# EAGLE design RFP (EAGLE 7.7.0)
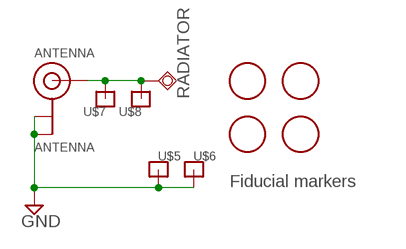
[diagram p0: schematic, sheet 1]

## Parts
ANTENNA  ANTENNA  ANTENNA_U.FL  [U.FL]
FD1  FIDUCIAL  [FIDUCIAL_1MM]
FD2  FIDUCIAL  [FIDUCIAL_1MM]
FD3  FIDUCIAL  [FIDUCIAL_1MM]
FD4  FIDUCIAL  [FIDUCIAL_1MM]
RADIATOR  TPSQTP20SQ  [TP20SQ]
U$5  2MMPILLAR  [2MMPILLAR]
U$6  2MMPILLAR  [2MMPILLAR]
U$7  2MMPILLAR  [2MMPILLAR]
U$8  2MMPILLAR  [2MMPILLAR]

## Nets
GND: ANTENNA.1(GND) ANTENNA.2(GND) U$5.P$1 U$6.P$1
SIGNAL: ANTENNA.3(SIGNAL) RADIATOR.TP U$7.P$1 U$8.P$1

## Notes on the sheet
- Fiducial markers

## Library data of the parts
ANTENNA = adafruit:ANTENNA_U.FL: U.FL Antenna Connector
FD1-FD4 = ubo_PQ60:FIDUCIAL: For use by pick and place machines to calibrate the vision/machine, 1mm By microbuilder.eu
RADIATOR = testpad:TPSQ: Test pad
U$5-U$8 = LMA:2MMPILLAR

## Board
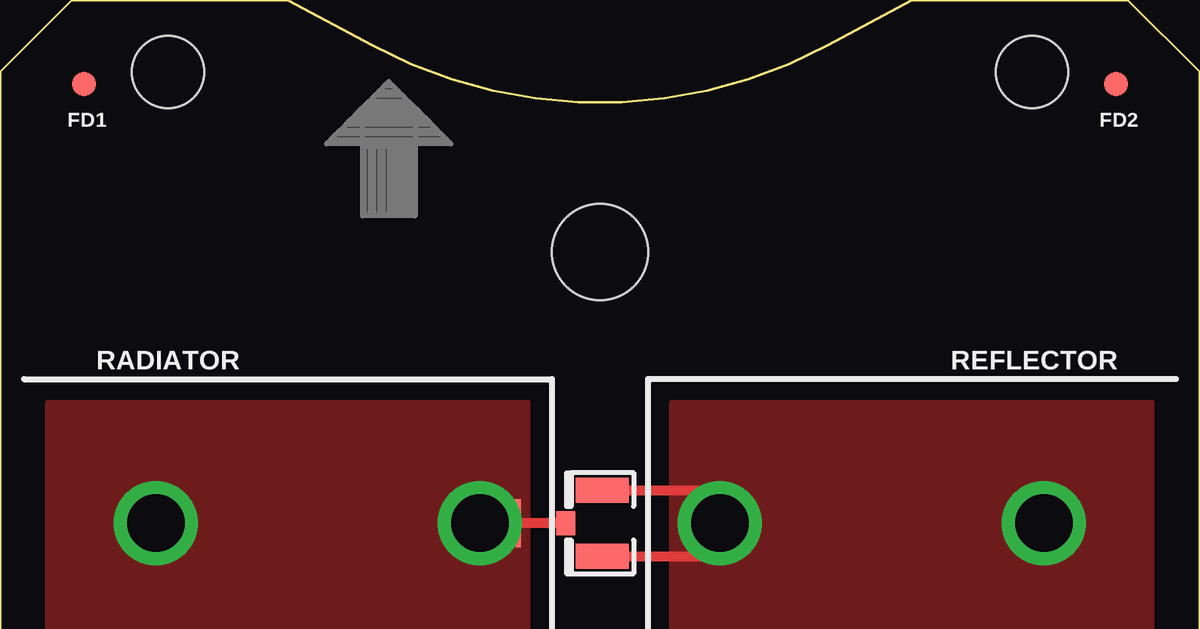
[diagram p1: board, top side]
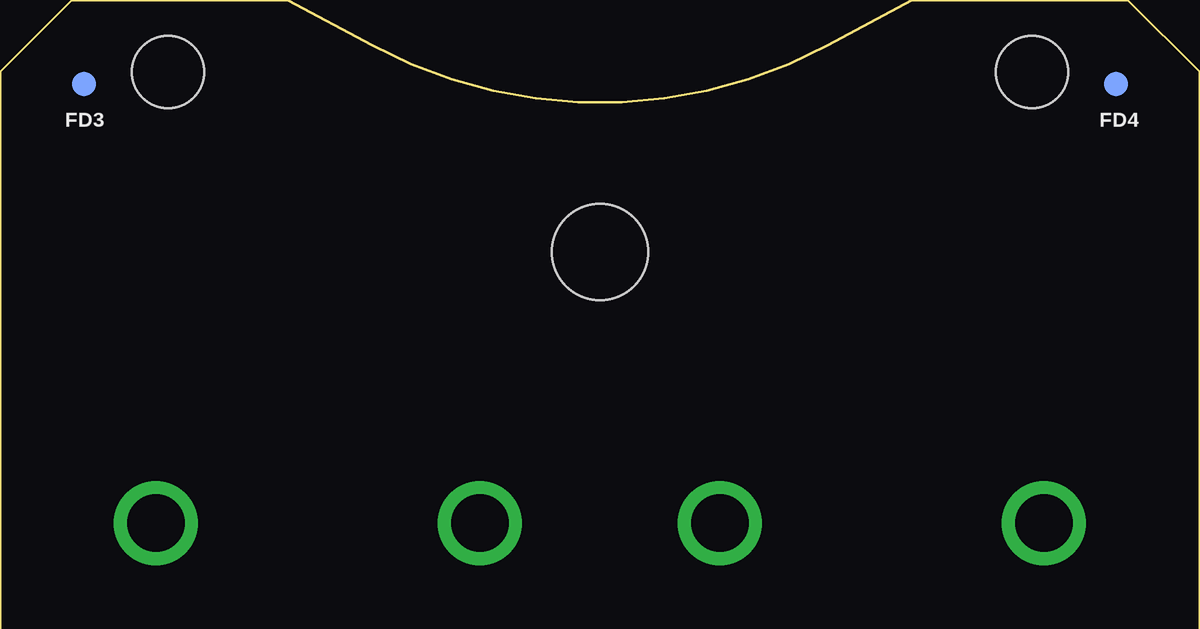
[diagram p2: board, bottom side, seen from below]

No outline drawn. Coordinates in mm, seen from the top.
Copper layers (1*16): Top 0.035mm / dielectric 1.5mm / Bottom 0.035mm
Design rules "default": minimum track width 10mil, minimum drill 24mil, track to track 8mil, track to pad 8mil, pad to pad 8mil, via to via 8mil, smd to smd 8mil, copper to edge 40mil, drill to drill 8mil, minimum pad ring 10mil, minimum via ring 8mil, stop-mask expansion 4mil, vias tented up to drill 0mil, thermal gap 10mil
Holes 4 mm at 25,35.5
Holes 3 mm at 7,43 43,43 43,7 7,7
tKeepout: 23 lines
Milling: 12 lines

### Footprints (pad centres in the part's own frame; a part is rotated, then mirrored left to right if it is on the bottom)
U.FL = smd 2.2 x 1.05: 1 0,1.375; 2 0,-1.375 | smd 0.8 x 1: 3 1.525,0
FIDUCIAL_1MM = smd 1 x 1: 1 0,0
TP20SQ = smd 2 x 2: TP 0,0
2MMPILLAR = drill 2.4 pad 3.5: P$1 0,0

### Placement (x,y rotation side)
ANTENNA  25.1,24.2 180 top
FD1  3.5,42.5 0 top
FD2  46.5,42.5 0 top
FD3  46.5,42.5 0 bottom
FD4  3.5,42.5 0 bottom
RADIATOR  20.7,24.2 0 top
U$5  43.5,24.2 0 top
U$6  30,24.2 0 top
U$7  6.5,24.2 0 top
U$8  20,24.2 0 top
U$9  [SA_LOGO_SMALL]  30.2,4 0 top
U$10  [PQ60_CMP]  12.4,4 0 top
U$12  [UBO_LOGO_LARGE]  18.9,5.3 0 top

### Tracks (layer width: path | path; a pad name or v marks a point on that pad's centre or on a via)
GND
  Top 0.406: ANTENNA.1 30,22.82 U$6.P$1 30,25.57 ANTENNA.2
  pour Top (no thermals): 48,29.2 28,29.2 28,19.2 48,19.2
SIGNAL
  Top 0.406: ANTENNA.3 RADIATOR.TP
  pour Top (no thermals): 22,29.2 2,29.2 2,19.2 22,19.2

### Text on the board
tNames: REFLECTOR
tDocu: Front | Designed and / manufactured / in the UK | Feed hole | Coax / jack | PocketQube / RFP | Ver. 2.0 / Rev. C | Copyright Satellite Applications Catapult 2019